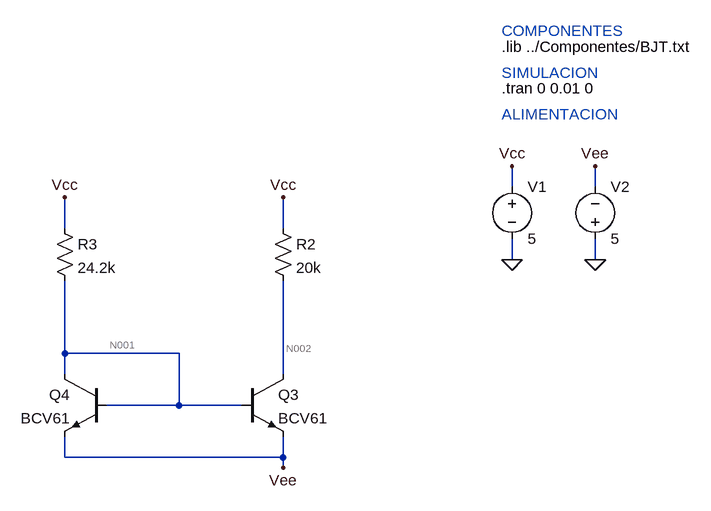
[diagram p0: schematic simulacion.asc]
simulacion.asc, the LTspice schematic file:
Version 4
SHEET 1 1252 828
WIRE 496 -16 496 -48
WIRE 624 -16 624 -48
WIRE -192 48 -192 0
WIRE 144 48 144 0
WIRE 496 96 496 64
WIRE 624 96 624 64
WIRE -192 176 -192 128
WIRE 144 192 144 128
WIRE -192 240 -192 176
WIRE -16 240 -192 240
WIRE -192 272 -192 240
WIRE 144 272 144 192
WIRE -16 320 -16 240
WIRE -16 320 -128 320
WIRE 80 320 -16 320
WIRE -192 400 -192 368
WIRE 144 400 144 368
WIRE 144 400 -192 400
WIRE 144 416 144 400
FLAG 496 96 0
FLAG 624 96 0
FLAG 496 -48 Vcc
FLAG 624 -48 Vee
FLAG 144 0 Vcc
FLAG 144 416 Vee
FLAG -192 0 Vcc
DATAFLAG 144 192 "I(R2)"
DATAFLAG -192 176 "I(R3)"
SYMBOL voltage 496 -32 R0
WINDOW 123 0 0 Left 2
WINDOW 39 0 0 Left 2
SYMATTR InstName V1
SYMATTR Value 5
SYMBOL voltage 624 80 M180
WINDOW 0 24 96 Left 2
WINDOW 3 24 16 Left 2
WINDOW 123 0 0 Left 2
WINDOW 39 0 0 Left 2
SYMATTR InstName V2
SYMATTR Value 5
SYMBOL npn 80 272 R0
SYMATTR InstName Q3
SYMATTR Value BCV61
SYMBOL npn -128 272 M0
SYMATTR InstName Q4
SYMATTR Value BCV61
SYMBOL res 128 32 R0
SYMATTR InstName R2
SYMATTR Value 20k
SYMBOL res -208 32 R0
SYMATTR InstName R3
SYMATTR Value 24.2k
TEXT 480 -232 Left 2 !.lib ../Componentes/BJT.txt
TEXT 480 -168 Left 2 !.tran 0 0.01 0
TEXT 480 -256 Left 2 ;COMPONENTES
TEXT 480 -192 Left 2 ;SIMULACION
TEXT 480 -128 Left 2 ;ALIMENTACION

The netlist it stands for:
* simulacion.asc
V1 Vcc 0 5
V2 0 Vee 5
Q3 N002 N001 Vee 0 BCV61
Q4 N001 N001 Vee 0 BCV61
R2 Vcc N002 20k
R3 Vcc N001 24.2k
.model NPN NPN
.model PNP PNP
.lib standard.bjt
.lib ../Componentes/BJT.txt
.tran 0 0.01 0
* COMPONENTES
* SIMULACION
* ALIMENTACION
.backanno
.end

* Results of the author's LTspice run, read from the files saved beside the schematic
* Operating Point, zero values left out:
*   V(vcc) = 5 V
*   V(vee) = -5 V
*   V(n002) = -2.857 V
*   V(n001) = -4.388 V
*   Ic(Q4) = 385.5 µA
*   Ib(Q4) = 1.241 µA
*   Ie(Q4) = -386.7 µA
*   Ic(Q3) = 392.8 µA
*   Ib(Q3) = 1.241 µA
*   Ie(Q3) = -394.1 µA
*   I(R3) = 387.9 µA
*   I(R2) = 392.8 µA
*   I(V2) = -780.8 µA
*   I(V1) = -780.8 µA